# Altium schematic sheet Power.SchDoc
size A
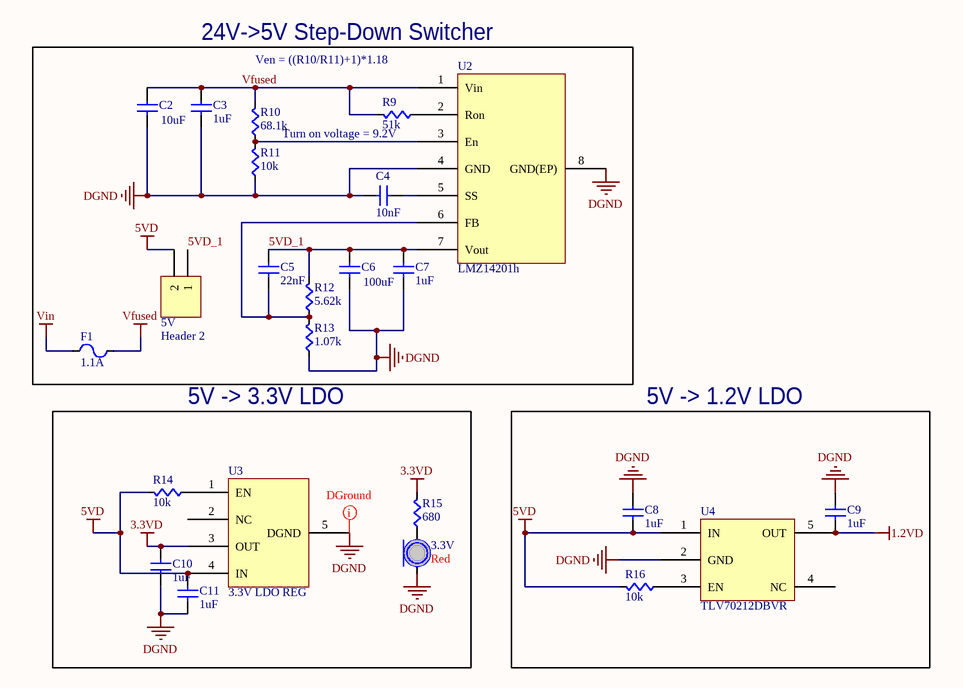
[diagram p0: Power.SchDoc]

## Parts
3.3V  Color: Red  [LED0805]  (hidden comment: LED)
5V  Header 2  [HDR1X2]
C2  value 10uF  [CAP1210]  (hidden comment: CAP1210)
C3  value 1uF  [CAP1206]  (hidden comment: Cap1206)
C4  value 10nF  [CAPC0603]  (hidden comment: Cap)
C5  value 22nF  [CAPC0603]  (hidden comment: Cap)
C6  value 100uF  [CAP1210]  (hidden comment: CAP1210)
C7  value 1uF  [CAP1206]  (hidden comment: Cap1206)
C8  value 1uF  [CAPC0603]  (hidden comment: Cap1206)
C9  value 1uF  [CAPC0603]  (hidden comment: Cap1206)
C10  value 1uF  [CAPC0603]  (hidden comment: Cap1206)
C11  value 1uF  [CAPC0603]  (hidden comment: Cap1206)
F1  value 1.1A  [PTC7451X11N]  (hidden comment: PTC Fuse)
R9  value 51k  [RES0603]  (hidden comment: Res)
R10  value 68.1k  [RES0603]  (hidden comment: Res)
R11  value 10k  [RES0603]  (hidden comment: Res)
R12  value 5.62k  [RES0603]  (hidden comment: Res)
R13  value 1.07k  [RES0603]  (hidden comment: Res)
R14  value 10k  [RES0603]  (hidden comment: Res)
R15  value 680  [RES0603]  (hidden comment: Res)
R16  value 10k  [RES0603]  (hidden comment: Res)
U2  LMZ14201h  [TO-PMOD-7]
U3  3.3V LDO REG  [SOT223-8N]
U4  TLV70212DBVR  [SOT23-5N]

## Blocks framed on the sheet
24V->5V Step-Down Switcher: 5V C2-C7 F1 R9-R13 U2
5V -> 3.3V LDO: 3.3V C10 C11 R14 R15 U3
5V -> 1.2V LDO: C8 C9 R16 U4

## Nets
1.2VD: C9.1(A) U4.5(OUT)
3.3VD: C10.1(A) R15.1(A) U3.3(OUT)
5VD: 5V.2 C8.1(A) C11.1(A) R14.1(A) R16.1(A) U3.4(IN) U4.1(IN)
DGND: 3.3V.C C2.2(B) C3.2(B) C4.1(A) C6.2(B) C7.2(B) C8.2(B) C9.2(B) C10.2(B) C11.2(B) R11.2(B) R13.2(B) U2.4(GND) U2.8(GND(EP)) U3.5(DGND) U4.2(GND)
Vfused: C2.1(A) C3.1(A) F1.2(B) R9.1(A) R10.1(A) U2.1(Vin)
Vin: F1.1(A)
5VD_1: 5V.1 C5.2(B) C6.1(A) C7.1(A) R12.1(A) U2.7(Vout)
Net3.3V_A: 3.3V.A R15.2(B)
NetC4_2: C4.2(B) U2.5(SS)
NetC5_1: C5.1(A) R12.2(B) R13.1(A) U2.6(FB)
NetR9_2: R9.2(B) U2.2(Ron)
NetR10_2: R10.2(B) R11.1(A) U2.3(En)
NetR14_2: R14.2(B) U3.1(EN)
NetR16_2: R16.2(B) U4.3(EN)

Not connected (* = marked no-connect by the designer): U3 2(NC); U4 4(NC)

## Layout directives
net class DGround: DGND

## Notes on the sheet
- Ven = ((R10/R11)+1)*1.18
- (near R9) Turn on voltage = 9.2V

## Library data of the parts
5V = Header 2: Header, 2-Pin; LatestRevisionDate: 17-Jul-2002; LatestRevisionNote: Re-released for DXP Platform.; Publisher: Altium Limited; Supplier Part Number 1: A1921-ND; Supplier 1: Digi-Key
C2 C6 = CAP1210: CAP CER 10UF 50V 20% X5R 1210; Supplier 1: Digi-Key
  C2: Supplier Part Number 1: 587-2225-1-ND
  C6: Supplier Part Number 1: 587-1387-1-ND
C3 C7-C11 = Cap1206: CAP CER 1UF 50V 10% X7R 1206; Supplier 1: Digi-Key; Supplier Part Number 1: 587-2230-1-ND
F1 = PTC_Fuse: Supplier 1: Digi-Key; Supplier Part Number 1: 507-1744-1-ND
U2 = LMZ14201h: IC BUCK SYNC ADJ 1A TO-PMOD-7; Supplier 1: Digi-Key; Supplier Part Number 1: LMZ14201HTZX/NOPBCT-ND
U3 = LP38691: IC REG LDO 3.3V 0.5A SOT223-5; Supplier 1: Digi-Key; Supplier Part Number 1: LP38693MP-3.3/NOPBCT-ND
U4 = TLV70212DBVR: IC REG LDO 1.2V 0.3A SOT23-5; Supplier 1: Digi-Key; Supplier Part Number 1: 296-29583-1-ND
3.3V = LED: Supplier 1: Digi-Key; Supplier Part Number 1: 754-1122-1-ND
C4 C5 = Cap: Supplier 1: Digi-Key; Supplier Part Number 1: 1276-1000-1-ND
R9-R16 = Res: Supplier 1: Digi-Key; Supplier Part Number 1: RMCF0603JT10K0CT-ND